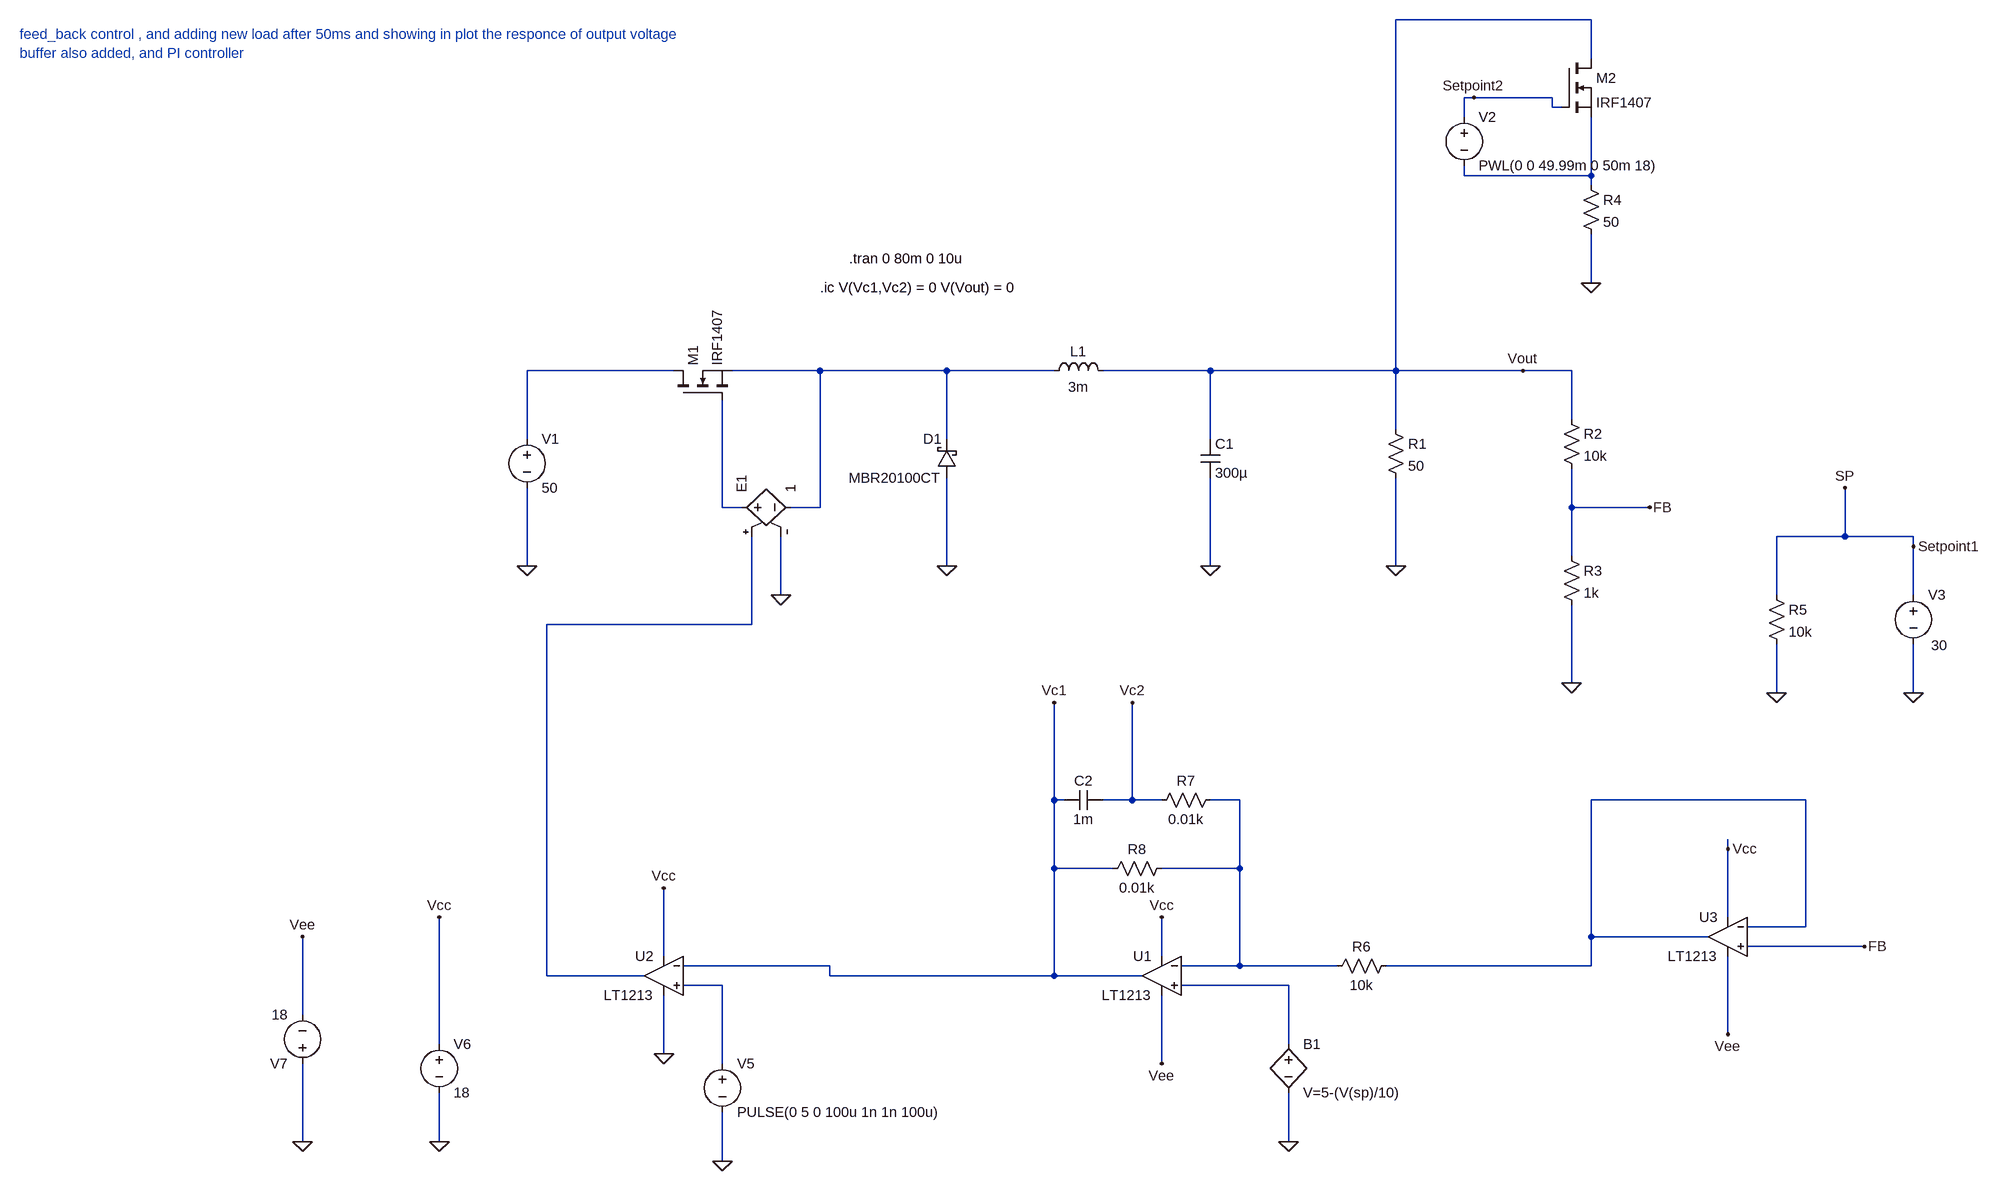
[diagram p0: schematic Feed_back control_PI_control.asc]
Feed_back control_PI_control.asc, the LTspice schematic file:
Version 4
SHEET 1 1772 1608
WIRE 912 -304 592 -304
WIRE 912 -240 912 -304
WIRE 720 -176 704 -176
WIRE 848 -176 720 -176
WIRE 848 -160 848 -176
WIRE 864 -160 848 -160
WIRE 704 -144 704 -176
WIRE 704 -48 704 -64
WIRE 912 -48 912 -144
WIRE 912 -48 704 -48
WIRE 912 -32 912 -48
WIRE 912 128 912 48
WIRE -592 272 -832 272
WIRE -352 272 -496 272
WIRE -144 272 -352 272
WIRE 32 272 -144 272
WIRE 288 272 112 272
WIRE 592 272 592 -304
WIRE 592 272 288 272
WIRE 800 272 592 272
WIRE 880 272 800 272
WIRE 880 352 880 272
WIRE 592 368 592 272
WIRE -832 384 -832 272
WIRE -144 384 -144 272
WIRE 288 384 288 272
WIRE -512 496 -512 320
WIRE -480 496 -512 496
WIRE -352 496 -352 272
WIRE -352 496 -400 496
WIRE 880 496 880 432
WIRE 1008 496 880 496
WIRE 1328 544 1328 464
WIRE 1328 544 1216 544
WIRE 1440 544 1328 544
WIRE 1440 560 1440 544
WIRE 880 576 880 496
WIRE -832 592 -832 464
WIRE -144 592 -144 448
WIRE 288 592 288 448
WIRE 592 592 592 448
WIRE -416 640 -416 544
WIRE 1216 640 1216 544
WIRE 1440 640 1440 560
WIRE -464 688 -464 544
WIRE -464 688 -800 688
WIRE 880 784 880 656
WIRE 1216 800 1216 720
WIRE 1440 800 1440 720
WIRE 32 976 32 816
WIRE 48 976 32 976
WIRE 160 976 160 816
WIRE 160 976 112 976
WIRE 208 976 160 976
WIRE 336 976 288 976
WIRE 1264 976 912 976
WIRE 1136 1056 1136 1040
WIRE 32 1088 32 976
WIRE 128 1088 32 1088
WIRE 336 1088 336 976
WIRE 336 1088 208 1088
WIRE 1136 1168 1136 1056
WIRE 1264 1184 1264 976
WIRE 1264 1184 1168 1184
WIRE 912 1200 912 976
WIRE 1104 1200 912 1200
WIRE 1360 1216 1168 1216
WIRE -608 1232 -608 1120
WIRE 208 1232 208 1168
WIRE -336 1248 -576 1248
WIRE 336 1248 336 1088
WIRE 336 1248 240 1248
WIRE 496 1248 336 1248
WIRE 912 1248 912 1200
WIRE 912 1248 576 1248
WIRE -800 1264 -800 688
WIRE -640 1264 -800 1264
WIRE -336 1264 -336 1248
WIRE 32 1264 32 1088
WIRE 32 1264 -336 1264
WIRE 176 1264 32 1264
WIRE -512 1280 -576 1280
WIRE 416 1280 240 1280
WIRE -1200 1328 -1200 1200
WIRE 1136 1360 1136 1232
WIRE -976 1376 -976 1168
WIRE 416 1376 416 1280
WIRE -608 1392 -608 1296
WIRE -512 1408 -512 1280
WIRE 208 1408 208 1296
WIRE -1200 1536 -1200 1408
WIRE -976 1536 -976 1456
WIRE 416 1536 416 1456
WIRE -512 1568 -512 1488
FLAG -832 592 0
FLAG -144 592 0
FLAG 288 592 0
FLAG 592 592 0
FLAG 880 784 0
FLAG 1008 496 FB
FLAG 912 128 0
FLAG 720 -176 Setpoint2
FLAG 1216 800 0
FLAG 1440 800 0
FLAG 1328 464 SP
FLAG 1440 560 Setpoint1
FLAG 416 1536 0
FLAG 208 1168 Vcc
FLAG 208 1408 Vee
FLAG -512 1568 0
FLAG -608 1392 0
FLAG -608 1120 Vcc
FLAG -976 1536 0
FLAG -1200 1536 0
FLAG -1200 1200 Vee
FLAG -976 1168 Vcc
FLAG -416 640 0
FLAG 32 816 Vc1
FLAG 160 816 Vc2
FLAG 800 272 Vout
FLAG 1136 1056 Vcc
FLAG 1136 1360 Vee
FLAG 1360 1216 FB
SYMBOL voltage -832 368 R0
WINDOW 123 0 0 Left 0
WINDOW 39 0 0 Left 0
SYMATTR InstName V1
SYMATTR Value 50
SYMBOL nmos -592 320 R270
SYMATTR InstName M1
SYMATTR Value IRF1407
SYMBOL ind 16 288 R270
WINDOW 0 32 56 VTop 2
WINDOW 3 5 56 VBottom 2
SYMATTR InstName L1
SYMATTR Value 3m
SYMBOL res 576 352 R0
SYMATTR InstName R1
SYMATTR Value 50
SYMBOL cap 272 384 R0
SYMATTR InstName C1
SYMATTR Value 300µ
SYMBOL schottky -128 448 R180
WINDOW 0 24 64 Left 2
WINDOW 3 24 0 Left 2
SYMATTR InstName D1
SYMATTR Value MBR20100CT
SYMATTR Description Diode
SYMATTR Type diode
SYMBOL OpAmps\\LT1213 208 1200 M0
SYMATTR InstName U1
SYMBOL res 864 336 R0
SYMATTR InstName R2
SYMATTR Value 10k
SYMBOL res 864 560 R0
SYMATTR InstName R3
SYMATTR Value 1k
SYMBOL voltage 704 -160 R0
WINDOW 123 0 0 Left 0
WINDOW 39 0 0 Left 0
SYMATTR InstName V2
SYMATTR Value PWL(0 0 49.99m 0 50m 18)
SYMBOL res 896 -48 R0
SYMATTR InstName R4
SYMATTR Value 50
SYMBOL nmos 864 -240 R0
SYMATTR InstName M2
SYMATTR Value IRF1407
SYMBOL voltage 1440 624 R0
WINDOW 3 29 98 Left 2
WINDOW 123 0 0 Left 0
WINDOW 39 0 0 Left 0
SYMATTR InstName V3
SYMATTR Value 30
SYMBOL res 1200 624 R0
SYMATTR InstName R5
SYMATTR Value 10k
SYMBOL res 592 1232 R90
WINDOW 0 0 56 VBottom 2
WINDOW 3 32 56 VTop 2
SYMATTR InstName R6
SYMATTR Value 10k
SYMBOL res 304 960 R90
WINDOW 0 0 56 VBottom 2
WINDOW 3 32 56 VTop 2
SYMATTR InstName R7
SYMATTR Value 0.01k
SYMBOL cap 48 992 R270
WINDOW 0 32 32 VTop 2
WINDOW 3 0 32 VBottom 2
SYMATTR InstName C2
SYMATTR Value 1m
SYMBOL OpAmps\\LT1213 -608 1200 M0
SYMATTR InstName U2
SYMBOL voltage -512 1392 R0
WINDOW 123 0 0 Left 0
WINDOW 39 0 0 Left 0
SYMATTR InstName V5
SYMATTR Value PULSE(0 5 0 100u 1n 1n 100u)
SYMBOL voltage -976 1360 R0
WINDOW 123 0 0 Left 0
WINDOW 39 0 0 Left 0
SYMATTR InstName V6
SYMATTR Value 18
SYMBOL voltage -1200 1424 R180
WINDOW 123 0 0 Left 0
WINDOW 39 0 0 Left 0
SYMATTR InstName V7
SYMATTR Value 18
SYMBOL e -496 496 R270
SYMATTR InstName E1
SYMATTR Value 1
SYMBOL bv 416 1360 R0
SYMATTR InstName B1
SYMATTR Value V=5-(V(sp)/10)
SYMBOL OpAmps\\LT1213 1136 1136 M0
SYMATTR InstName U3
SYMBOL res 224 1072 R90
WINDOW 0 0 56 VBottom 2
WINDOW 3 32 56 VTop 2
SYMATTR InstName R8
SYMATTR Value 0.01k
TEXT -304 88 Left 2 !.tran 0 80m 0 10u
TEXT -352 136 Left 2 !.ic V(Vc1,Vc2) = 0 V(Vout) = 0
TEXT -1664 -280 Left 2 ;feed_back control , and adding new load after 50ms and showing in plot the responce of output voltage\nbuffer also added, and PI controller

The netlist it stands for:
* Feed_back control_PI_control.asc
V1 N002 0 50
M1 N002 N004 N003 N003 IRF1407
L1 N003 Vout 3m
R1 Vout 0 50
C1 Vout 0 300µ
D1 0 N003 MBR20100CT
XU1 N009 N006 Vcc Vee Vc1 LT1213  ; pins In+ In- V+ V- OUT
R2 Vout FB 10k
R3 FB 0 1k
V2 Setpoint2 N001 PWL(0 0 49.99m 0 50m 18)
R4 N001 0 50
M2 Vout Setpoint2 N001 N001 IRF1407
V3 Setpoint1 0 30
R5 Setpoint1 0 10k
R6 N007 N006 10k
R7 N006 Vc2 0.01k
C2 Vc1 Vc2 1m
XU2 N008 Vc1 Vcc 0 N005 LT1213  ; pins In+ In- V+ V- OUT
V5 N008 0 PULSE(0 5 0 100u 1n 1n 100u)
V6 Vcc 0 18
V7 0 Vee 18
E1 N004 N003 N005 0 1
B1 N009 0 V=5-(V(sp)/10)
XU3 FB N007 Vcc Vee N007 LT1213  ; pins In+ In- V+ V- OUT
R8 N006 Vc1 0.01k
.model D D
.lib standard.dio
.model NMOS NMOS
.model PMOS PMOS
.lib standard.mos
.tran 0 80m 0 10u
.ic V(Vc1,Vc2) = 0 V(Vout) = 0
* feed_back control , and adding new load after 50ms and showing in plot the responce of output voltage
* buffer also added, and PI controller
.lib LTC.lib
.backanno
.end